# Altium schematic sheet BW1097_TopLevel.SchDoc: =project_title
size Tabloid; PageSetup: Record=PageOptions|CenterHorizontal=True|CenterVertical=True|PrintScale=0.73|XCorrection=1.00|YCorrection=1.00|PrintKind=0|BorderSize=5000000|LeftOffset=0|BottomOffset=0|Orientation=2|PaperLength=1000|PaperWidth=1000|Scale=100|PaperSource=7|PrintQuality=-4|MediaType=1|DitherType=10|PaperKind=A4|PrintScaleMode=1; CompanyName: Luxonis Holding; Organization: Luxonis Holding; Address1: 1925 Harmony Park Drive; Address2: Westminster, CO; Address3: 80234; Address4: United States; SheetNumber: 2; SheetTotal: 17
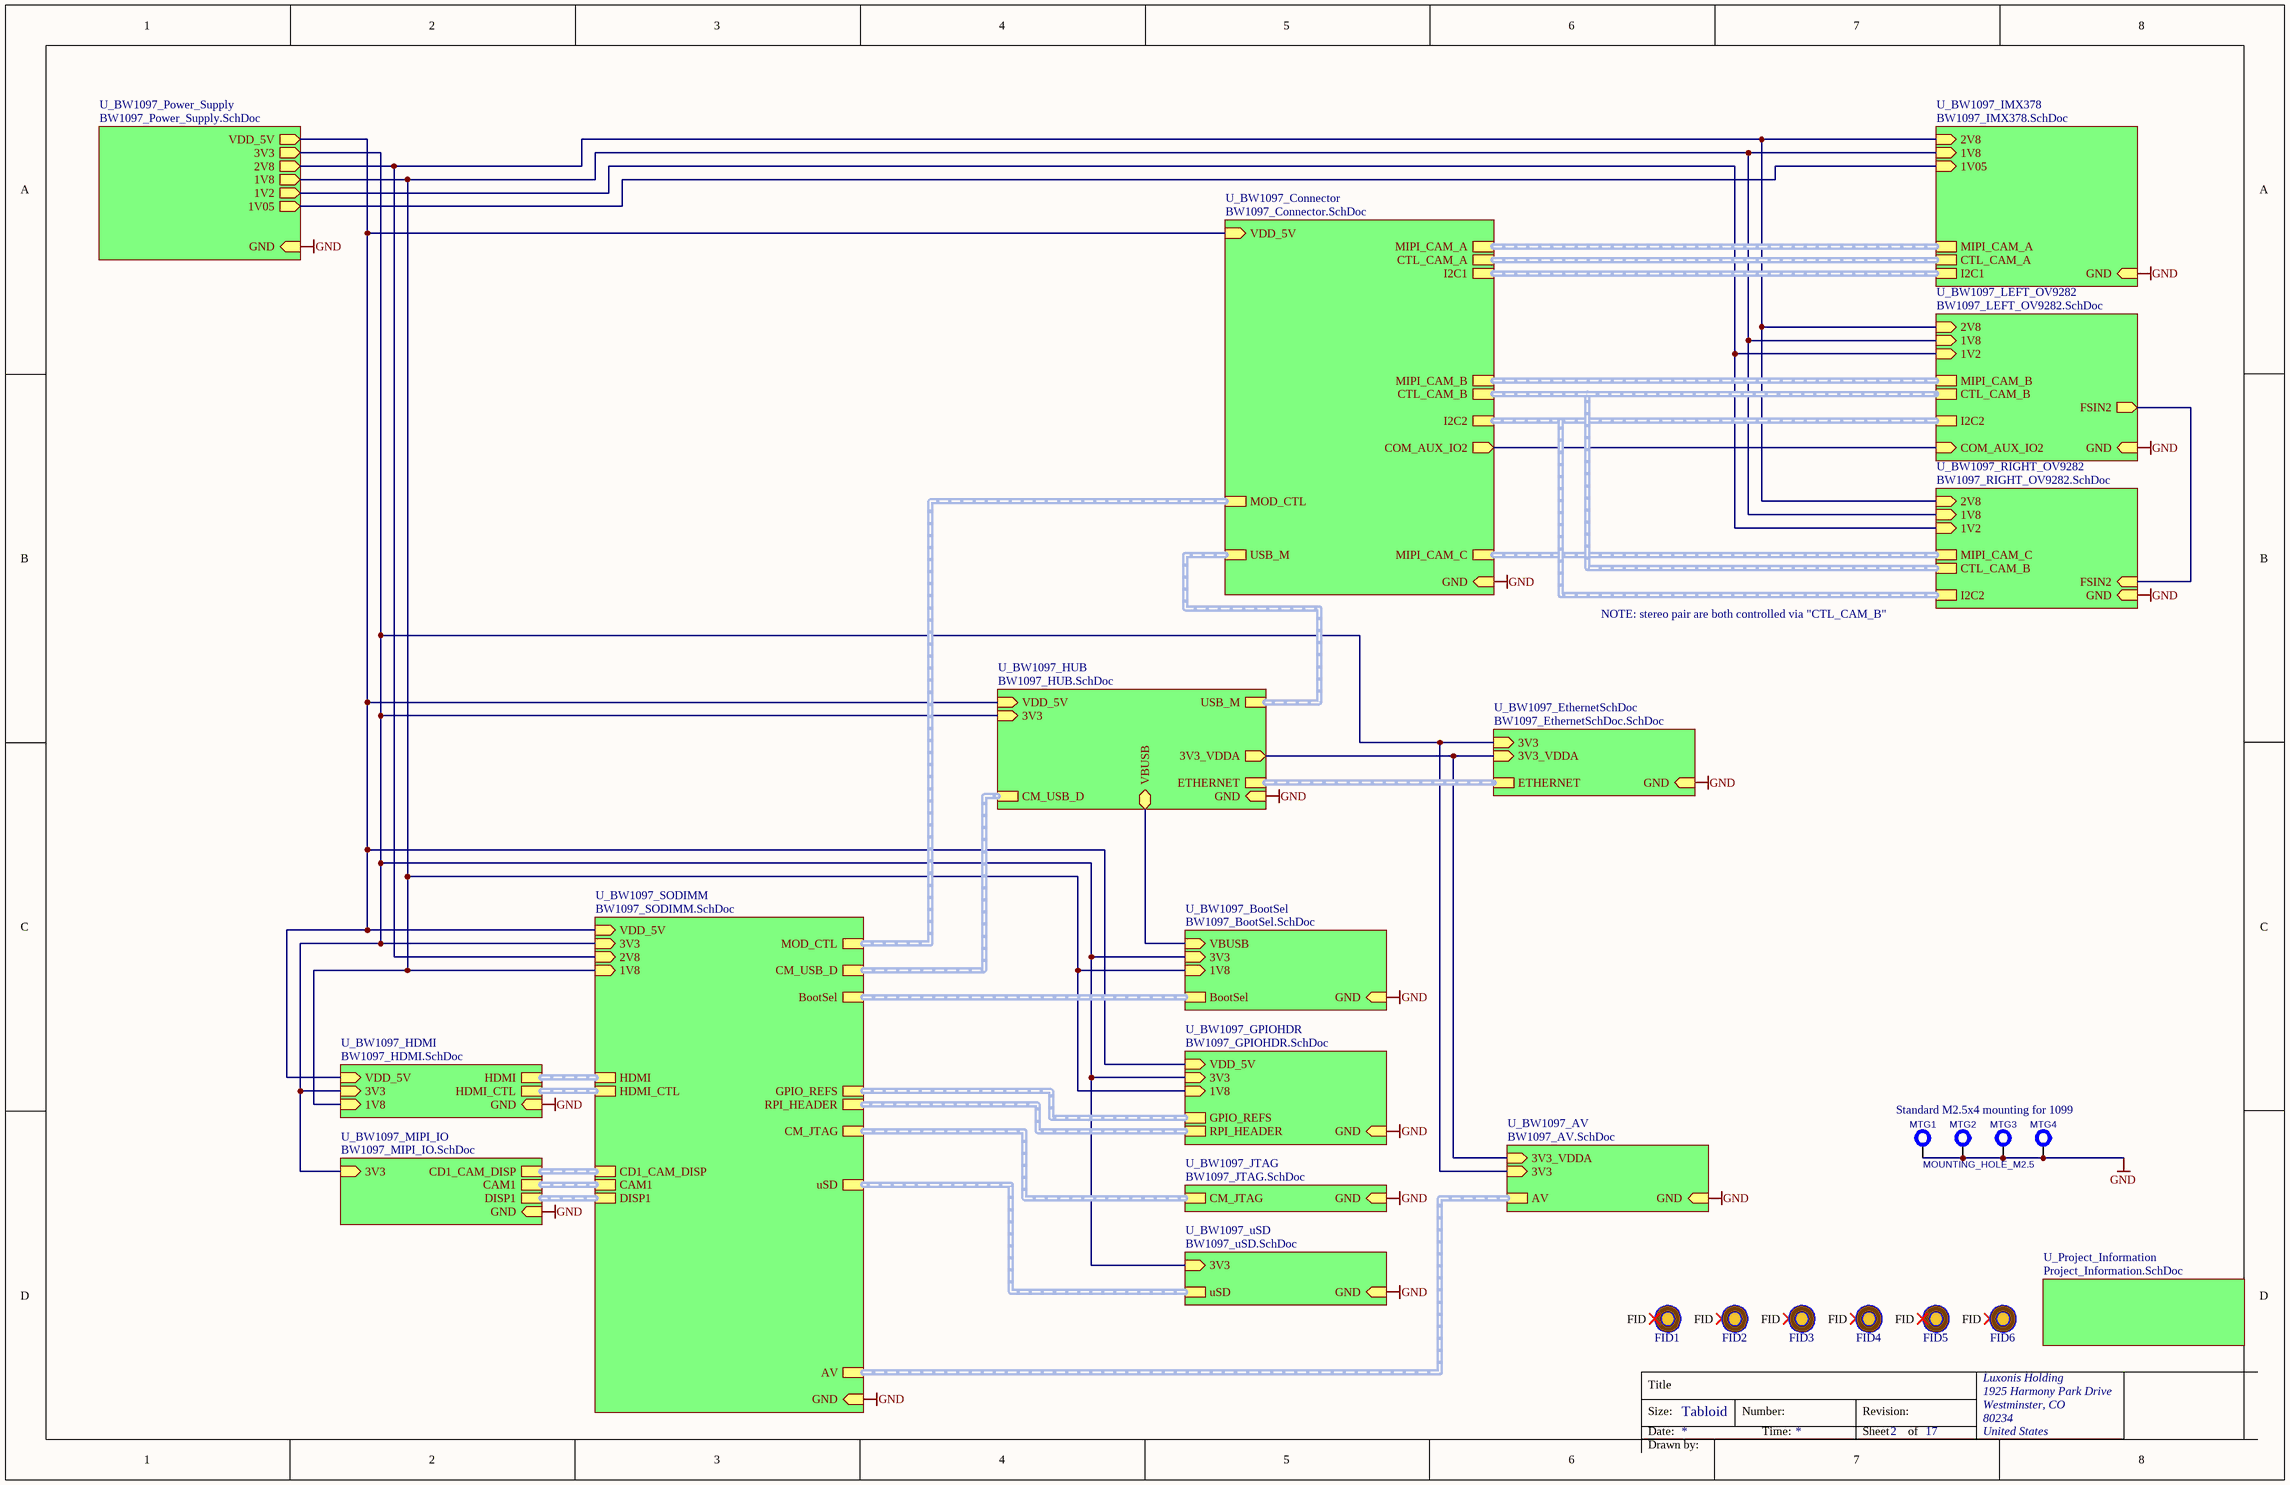
[diagram p0: BW1097_TopLevel.SchDoc]

## Parts
FID1  FIDUCIAL_ROUND_1MM  [FIDUCIAL_ROUND_1MM]  (value not drawn)  (no BOM)
FID2  FIDUCIAL_ROUND_1MM  [FIDUCIAL_ROUND_1MM]  (value not drawn)  (no BOM)
FID3  FIDUCIAL_ROUND_1MM  [FIDUCIAL_ROUND_1MM]  (value not drawn)  (no BOM)
FID4  FIDUCIAL_ROUND_1MM  [FIDUCIAL_ROUND_1MM]  (value not drawn)  (no BOM)
FID5  FIDUCIAL_ROUND_1MM  [FIDUCIAL_ROUND_1MM]  (value not drawn)  (no BOM)
FID6  FIDUCIAL_ROUND_1MM  [FIDUCIAL_ROUND_1MM]  (value not drawn)  (no BOM)
MTG1  MOUNTING_HOLE_M2.5  [MOUNTING_HOLE_M2.5]  (value not drawn)  (no BOM)
MTG2  MOUNTING_HOLE_M2.5  [MOUNTING_HOLE_M2.5]  (value not drawn)  (no BOM)
MTG3  MOUNTING_HOLE_M2.5  [MOUNTING_HOLE_M2.5]  (value not drawn)  (no BOM)
MTG4  MOUNTING_HOLE_M2.5  [MOUNTING_HOLE_M2.5]  (no BOM)

## Sub-sheets
U_BW1097_AV = BW1097_AV.SchDoc: AV (harness AV), 3V3 (in), GND (in), 3V3_VDDA (in)
U_BW1097_BootSel = BW1097_BootSel.SchDoc: 1V8 (in), VBUSB (in), 3V3 (in), BootSel (harness BootSel), GND (in)
U_BW1097_Connector = BW1097_Connector.SchDoc: MIPI_CAM_B (harness MIPI_CAM_B), MIPI_CAM_A (harness MIPI_CAM_A), MIPI_CAM_C (harness MIPI_CAM_C), I2C2 (harness I2C2), I2C1 (harness I2C1), CTL_CAM_A (harness CTL_CAM_A), CTL_CAM_B (harness CTL_CAM_B), VDD_5V (in), USB_M (harness USB_M), GND (in), MOD_CTL (harness MOD_CTL), COM_AUX_IO2 (out)
U_BW1097_EthernetSchDoc = BW1097_EthernetSchDoc.SchDoc: 3V3 (in), ETHERNET (harness ETHERNET), GND (in), 3V3_VDDA (in)
U_BW1097_GPIOHDR = BW1097_GPIOHDR.SchDoc: GPIO_REFS (harness GPIO_REFS), RPI_HEADER (harness RPI_HEADER), 3V3 (in), GND (in), VDD_5V (in), 1V8 (in)
U_BW1097_HDMI = BW1097_HDMI.SchDoc: HDMI_CTL (harness HDMI_CTL), HDMI (harness HDMI), 3V3 (in), GND (in), VDD_5V (in), 1V8 (in)
U_BW1097_HUB = BW1097_HUB.SchDoc: CM_USB_D (harness CM _USB_D), USB_M (harness USB_M), VDD_5V (in), 3V3 (in), ETHERNET (harness ETHERNET), GND (in), 3V3_VDDA (out), VBUSB (bidir)
U_BW1097_IMX378 = BW1097_IMX378.SchDoc: 2V8 (in), 1V05 (in), I2C1 (harness I2C1), MIPI_CAM_A (harness MIPI_CAM_A), CTL_CAM_A (harness CTL_CAM_A), GND (in), 1V8 (in)
U_BW1097_JTAG = BW1097_JTAG.SchDoc: CM_JTAG (harness CM_JTAG), GND (in)
U_BW1097_LEFT_OV9282 = BW1097_LEFT_OV9282.SchDoc: I2C2 (harness I2C2), CTL_CAM_B (harness CTL_CAM_B), MIPI_CAM_B (harness MIPI_CAM_B), 1V2 (in), 2V8 (in), GND (in), 1V8 (in), FSIN2 (out), COM_AUX_IO2 (in)
U_BW1097_MIPI_IO = BW1097_MIPI_IO.SchDoc: 3V3 (in), GND (in), DISP1 (harness DISP1), CAM1 (harness CAM1), CD1_CAM_DISP (harness CD1_CAM_DISP)
U_BW1097_Power_Supply = BW1097_Power_Supply.SchDoc: 1V8 (out), 2V8 (out), 1V05 (out), VDD_5V (out), GND (in), 3V3 (out), 1V2 (out)
U_BW1097_RIGHT_OV9282 = BW1097_RIGHT_OV9282.SchDoc: I2C2 (harness I2C2), 1V2 (in), 2V8 (in), GND (in), 1V8 (in), FSIN2 (in), MIPI_CAM_C (harness MIPI_CAM_C), CTL_CAM_B (harness CTL_CAM_B)
U_BW1097_SODIMM = BW1097_SODIMM.SchDoc: CM_JTAG (harness CM_JTAG), uSD (harness uSD), GPIO_REFS (harness GPIO_REFS), BootSel (harness BootSel), HDMI (harness HDMI), CM_USB_D (harness CM_USB_D), HDMI_CTL (harness HDMI_CTL), GND (in), RPI_HEADER (harness RPI_HEADER), CD1_CAM_DISP (harness CD1_CAM_DISP), DISP1 (harness DISP1), CAM1 (harness CAM1), 3V3 (in), AV (harness AV), VDD_5V (in), 1V8 (in), 2V8 (in), MOD_CTL (harness MOD_CTL)
U_BW1097_uSD = BW1097_uSD.SchDoc: uSD (harness uSD), 3V3 (in), GND (in)
U_Project_Information = Project_Information.SchDoc: no entries

## Nets
GND: MTG1.1 MTG2.1 MTG3.1 MTG4.1 ; sheet U_BW1097_IMX378/GND, sheet U_BW1097_Connector/GND, sheet U_BW1097_SODIMM/GND, sheet U_BW1097_JTAG/GND, sheet U_BW1097_uSD/GND, sheet U_BW1097_BootSel/GND, sheet U_BW1097_GPIOHDR/GND, sheet U_BW1097_HUB/GND, sheet U_BW1097_EthernetSchDoc/GND, sheet U_BW1097_MIPI_IO/GND, sheet U_BW1097_AV/GND, sheet U_BW1097_RIGHT_OV9282/GND, sheet U_BW1097_LEFT_OV9282/GND, sheet U_BW1097_Power_Supply/GND, sheet U_BW1097_HDMI/GND
(unnamed): sheet U_BW1097_IMX378/2V8, sheet U_BW1097_SODIMM/2V8, sheet U_BW1097_RIGHT_OV9282/2V8, sheet U_BW1097_LEFT_OV9282/2V8, sheet U_BW1097_Power_Supply/2V8
(unnamed): sheet U_BW1097_IMX378/1V05, sheet U_BW1097_Power_Supply/1V05
(unnamed): sheet U_BW1097_IMX378/1V8, sheet U_BW1097_SODIMM/1V8, sheet U_BW1097_BootSel/1V8, sheet U_BW1097_GPIOHDR/1V8, sheet U_BW1097_RIGHT_OV9282/1V8, sheet U_BW1097_LEFT_OV9282/1V8, sheet U_BW1097_Power_Supply/1V8, sheet U_BW1097_HDMI/1V8
(unnamed): sheet U_BW1097_Connector/VDD_5V, sheet U_BW1097_SODIMM/VDD_5V, sheet U_BW1097_GPIOHDR/VDD_5V, sheet U_BW1097_HUB/VDD_5V, sheet U_BW1097_Power_Supply/VDD_5V, sheet U_BW1097_HDMI/VDD_5V
(unnamed): sheet U_BW1097_Connector/COM_AUX_IO2, sheet U_BW1097_LEFT_OV9282/COM_AUX_IO2
(unnamed): sheet U_BW1097_SODIMM/3V3, sheet U_BW1097_uSD/3V3, sheet U_BW1097_BootSel/3V3, sheet U_BW1097_GPIOHDR/3V3, sheet U_BW1097_HUB/3V3, sheet U_BW1097_EthernetSchDoc/3V3, sheet U_BW1097_MIPI_IO/3V3, sheet U_BW1097_AV/3V3, sheet U_BW1097_Power_Supply/3V3, sheet U_BW1097_HDMI/3V3
(unnamed): sheet U_BW1097_BootSel/VBUSB, sheet U_BW1097_HUB/VBUSB
(unnamed): sheet U_BW1097_HUB/3V3_VDDA, sheet U_BW1097_EthernetSchDoc/3V3_VDDA, sheet U_BW1097_AV/3V3_VDDA
(unnamed): sheet U_BW1097_RIGHT_OV9282/1V2, sheet U_BW1097_LEFT_OV9282/1V2, sheet U_BW1097_Power_Supply/1V2
(unnamed): sheet U_BW1097_RIGHT_OV9282/FSIN2, sheet U_BW1097_LEFT_OV9282/FSIN2

Not connected (* = marked no-connect by the designer): FID1 FID*; FID2 FID*; FID3 FID*; FID4 FID*; FID5 FID*; FID6 FID*

## Buses and harness runs
harness sheet U_BW1097_AV/AV = sheet U_BW1097_SODIMM/AV
harness sheet U_BW1097_BootSel/BootSel = sheet U_BW1097_SODIMM/BootSel
harness sheet U_BW1097_Connector/CTL_CAM_A = sheet U_BW1097_IMX378/CTL_CAM_A
harness sheet U_BW1097_Connector/CTL_CAM_B = sheet U_BW1097_LEFT_OV9282/CTL_CAM_B = sheet U_BW1097_RIGHT_OV9282/CTL_CAM_B
harness sheet U_BW1097_Connector/I2C1 = sheet U_BW1097_IMX378/I2C1
harness sheet U_BW1097_Connector/I2C2 = sheet U_BW1097_LEFT_OV9282/I2C2 = sheet U_BW1097_RIGHT_OV9282/I2C2
harness sheet U_BW1097_Connector/MIPI_CAM_A = sheet U_BW1097_IMX378/MIPI_CAM_A
harness sheet U_BW1097_Connector/MIPI_CAM_B = sheet U_BW1097_LEFT_OV9282/MIPI_CAM_B
harness sheet U_BW1097_Connector/MIPI_CAM_C = sheet U_BW1097_RIGHT_OV9282/MIPI_CAM_C
harness sheet U_BW1097_Connector/MOD_CTL = sheet U_BW1097_SODIMM/MOD_CTL
harness sheet U_BW1097_Connector/USB_M = sheet U_BW1097_HUB/USB_M
harness sheet U_BW1097_EthernetSchDoc/ETHERNET = sheet U_BW1097_HUB/ETHERNET
harness sheet U_BW1097_GPIOHDR/GPIO_REFS = sheet U_BW1097_SODIMM/GPIO_REFS
harness sheet U_BW1097_GPIOHDR/RPI_HEADER = sheet U_BW1097_SODIMM/RPI_HEADER
harness sheet U_BW1097_HDMI/HDMI = sheet U_BW1097_SODIMM/HDMI
harness sheet U_BW1097_HDMI/HDMI_CTL = sheet U_BW1097_SODIMM/HDMI_CTL
harness sheet U_BW1097_HUB/CM_USB_D = sheet U_BW1097_SODIMM/CM_USB_D
harness sheet U_BW1097_JTAG/CM_JTAG = sheet U_BW1097_SODIMM/CM_JTAG
harness sheet U_BW1097_MIPI_IO/CAM1 = sheet U_BW1097_SODIMM/CAM1
harness sheet U_BW1097_MIPI_IO/CD1_CAM_DISP = sheet U_BW1097_SODIMM/CD1_CAM_DISP
harness sheet U_BW1097_MIPI_IO/DISP1 = sheet U_BW1097_SODIMM/DISP1
harness sheet U_BW1097_SODIMM/uSD = sheet U_BW1097_uSD/uSD

## Notes on the sheet
- NOTE: stereo pair are both controlled via "CTL_CAM_B"
- Standard M2.5x4 mounting for 1099
- Title
- Size:
- Date:
- Tabloid
- Number:
- Time:
- Revision:
- Sheet
- of
- Drawn by:

## Library data of the parts
FID1-FID6 = FIDUCIAL: Fiducial with various available footprints
MTG1-MTG4 = MP_Mounting-Holes: =CurrentFootprint; B - Value: Not a Part; A - Level: 0